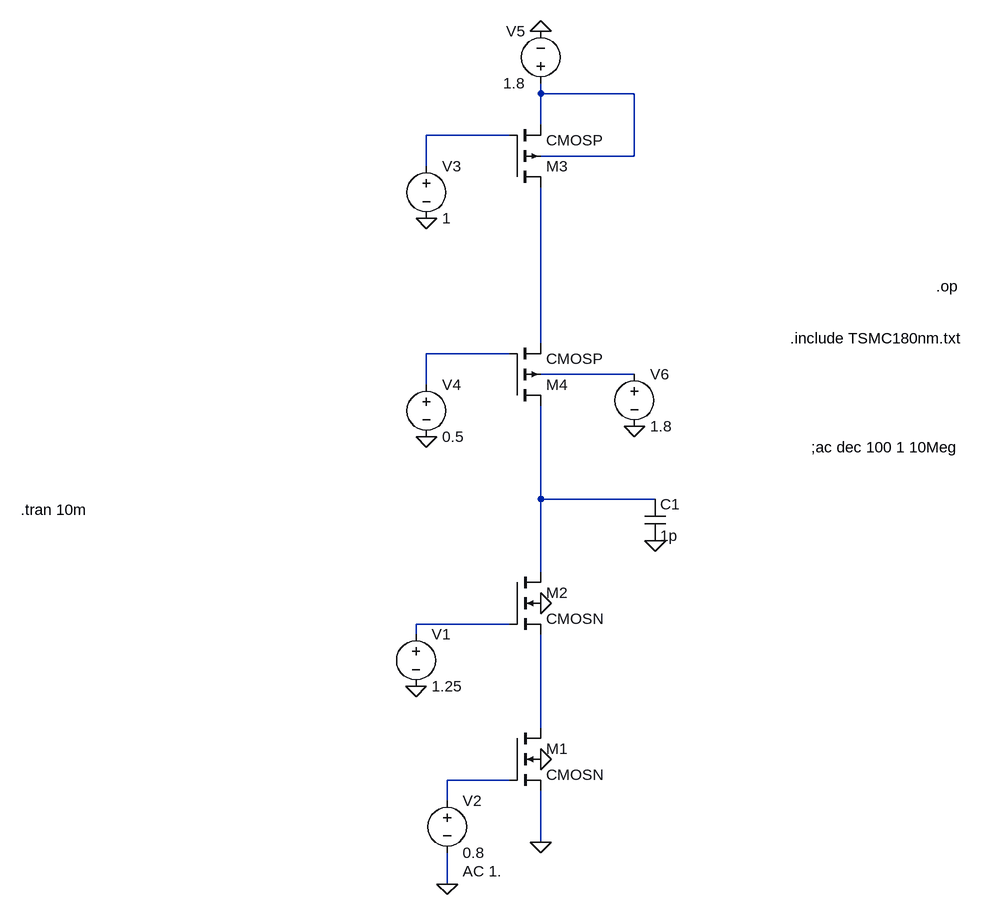
[diagram p0: schematic akshat_180nm1.asc]
akshat_180nm1.asc, the LTspice schematic file:
Version 4
SHEET 1 1192 868
WIRE 288 -368 288 -384
WIRE 432 -368 288 -368
WIRE 288 -320 288 -368
WIRE 240 -304 112 -304
WIRE 432 -272 432 -368
WIRE 432 -272 288 -272
WIRE 112 -256 112 -304
WIRE 288 16 288 -224
WIRE 240 32 112 32
WIRE 432 64 288 64
WIRE 112 80 112 32
WIRE 288 256 288 112
WIRE 464 256 288 256
WIRE 288 368 288 256
WIRE 240 448 96 448
WIRE 96 464 96 448
WIRE 288 608 288 464
WIRE 240 688 144 688
WIRE 144 720 144 688
WIRE 288 784 288 704
WIRE 144 848 144 800
FLAG 288 656 0
FLAG 288 784 0
FLAG 144 848 0
FLAG 96 544 0
FLAG 288 416 0
FLAG 288 -464 0
FLAG 112 -176 0
FLAG 112 160 0
FLAG 432 144 0
FLAG 464 320 0
DATAFLAG 288 -128 ""
DATAFLAG 288 256 ""
DATAFLAG 288 544 ""
SYMBOL nmos4 240 608 R0
SYMATTR InstName M1
SYMATTR Value CMOSN
SYMATTR Value2 l=0.36u w=5.04u
SYMBOL nmos4 240 368 R0
SYMATTR InstName M2
SYMATTR Value CMOSN
SYMATTR Value2 l=0.36u w=5.4u
SYMBOL voltage 96 448 R0
WINDOW 123 0 0 Left 0
WINDOW 39 0 0 Left 0
SYMATTR InstName V1
SYMATTR Value 1.25
SYMBOL voltage 144 704 R0
WINDOW 123 24 124 Left 2
WINDOW 39 0 0 Left 0
SYMATTR Value2 AC 1.
SYMATTR InstName V2
SYMATTR Value 0.8
SYMBOL pmos4 240 -224 M180
SYMATTR InstName M3
SYMATTR Value CMOSP
SYMATTR Value2 l=0.36u w=17.82u
SYMBOL pmos4 240 112 M180
SYMATTR InstName M4
SYMATTR Value CMOSP
SYMATTR Value2 l=0.36u w=21.6u
SYMBOL voltage 112 -272 R0
WINDOW 123 0 0 Left 0
WINDOW 39 0 0 Left 0
SYMATTR InstName V3
SYMATTR Value 1
SYMBOL voltage 112 64 R0
WINDOW 123 0 0 Left 0
WINDOW 39 0 0 Left 0
SYMATTR InstName V4
SYMATTR Value 0.5
SYMBOL voltage 288 -368 R180
WINDOW 0 24 96 Left 2
WINDOW 3 24 16 Left 2
WINDOW 123 0 0 Left 0
WINDOW 39 0 0 Left 0
SYMATTR InstName V5
SYMATTR Value 1.8
SYMBOL voltage 432 48 R0
WINDOW 123 0 0 Left 0
WINDOW 39 0 0 Left 0
SYMATTR InstName V6
SYMATTR Value 1.8
SYMBOL cap 448 256 R0
SYMATTR InstName C1
SYMATTR Value 1p
TEXT 672 8 Left 2 !.include TSMC180nm.txt
TEXT 704 176 Left 2 !;ac dec 100 1 10Meg
TEXT -512 272 Left 2 !.tran 10m
TEXT 896 -72 Left 2 !.op

The netlist it stands for:
* akshat_180nm1.asc
M1 N008 N009 0 0 CMOSN l=0.36u w=5.04u
M2 N006 N007 N008 0 CMOSN l=0.36u w=5.4u
V1 N007 0 1.25
V2 N009 0 0.8 AC 1.
M3 N003 N002 N001 N001 CMOSP l=0.36u w=17.82u
M4 N006 N004 N003 N005 CMOSP l=0.36u w=21.6u
V3 N002 0 1
V4 N004 0 0.5
V5 N001 0 1.8
V6 N005 0 1.8
C1 N006 0 1p
.model NMOS NMOS
.model PMOS PMOS
.lib standard.mos
.include TSMC180nm.txt
;ac dec 100 1 10Meg
.tran 10m
.op
.backanno
.end